# Altium project MacSet-L_V2.0.PrjPcb
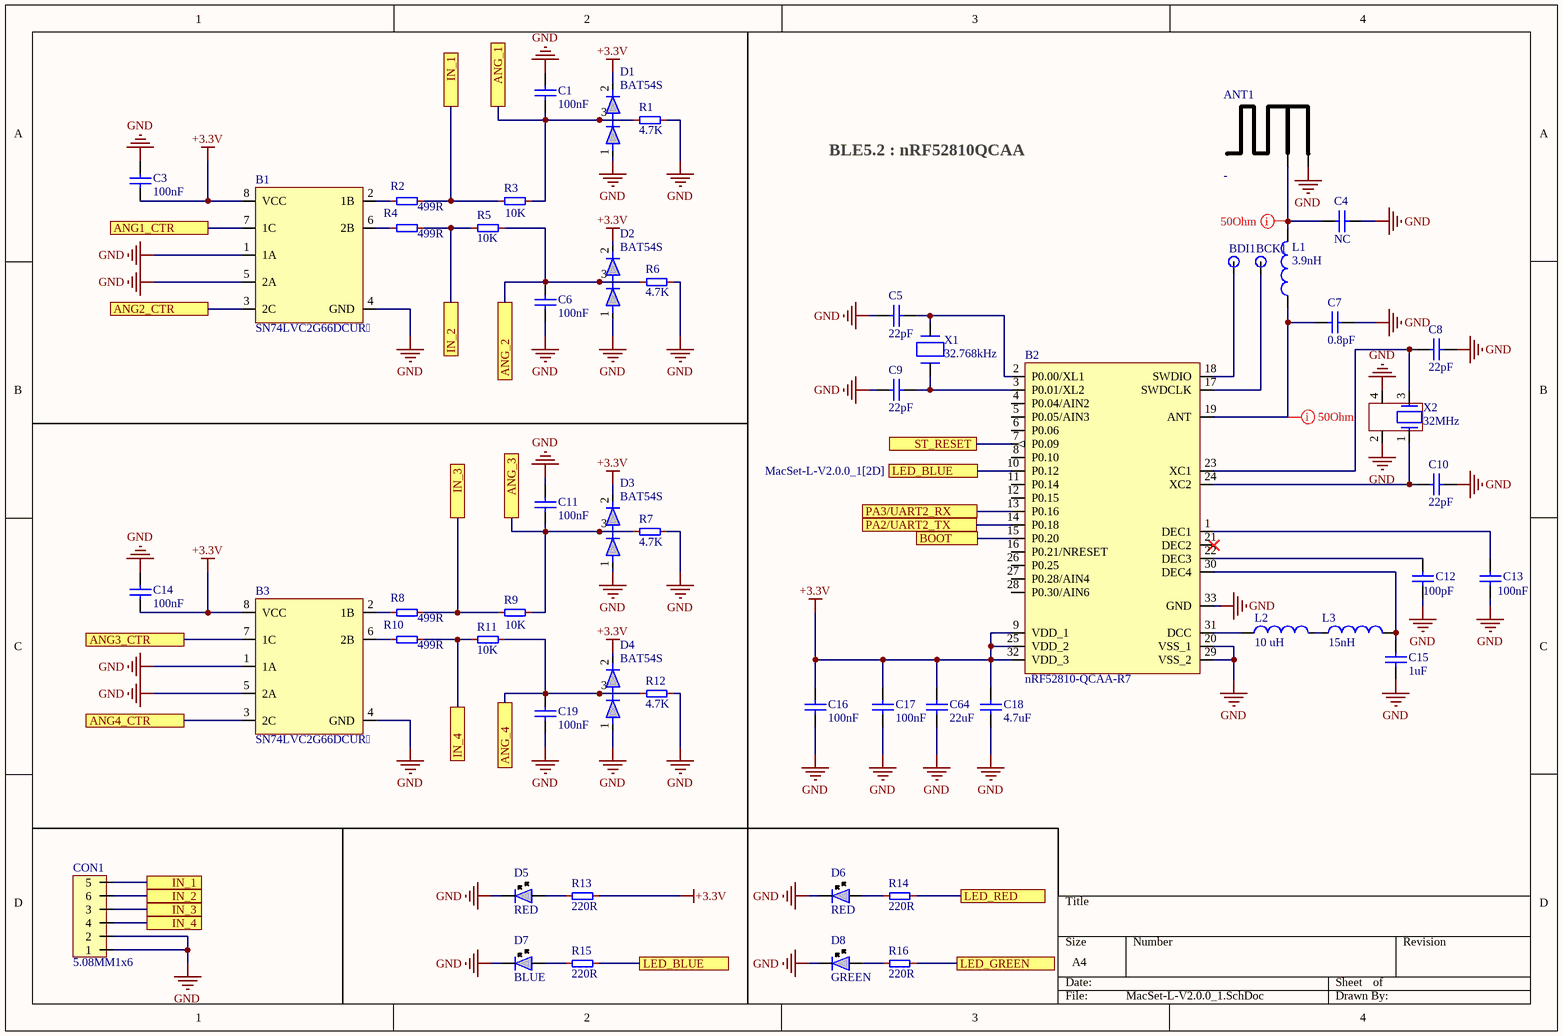
[diagram p0: MacSet-L-V2.0.0_1.SchDoc]
3 sheets, 169 parts. Net scope: flat (ports and power ports of the same name join across sheets).
Board file: MacSet-L_V2.0.PcbDoc
Sheets:
  MacSet-L-V2.0.0_1.SchDoc
  MacSet-L-V2.0.0_2.SchDoc
  MacSet-L-V2.0.0_3.SchDoc

## Sheet MacSet-L-V2.0.0_1.SchDoc
size A4; SheetNumber: 1; SheetTotal: 3

### Parts
ANT1  -  [2.4GHz PCB Anttenna]  (net tie, no BOM)
B1  SN74LVC2G66DCUR  [SOP50P310X90-8N]
B2  nRF52810-QCAA-R7  [QFN50P500X500X95-33N]
B3  SN74LVC2G66DCUR  [SOP50P310X90-8N]
BCK1  -  [TH_Pad]  (value not drawn)  (net tie, no BOM)
BDI1  -  [TH_Pad]  (value not drawn)  (net tie, no BOM)
C1  100nF  [CAP0402]
C3  100nF  [CAP0402]
C4  NC  [CAP0402]  (net tie, no BOM)
C5  22pF  [CAP0402]
C6  100nF  [CAP0402]
C7  0.8pF  [CAP0402]
C8  22pF  [CAP0402]
C9  22pF  [CAP0402]
C10  22pF  [CAP0402]
C11  100nF  [CAP0402]
C12  100pF  [CAP0402]
C13  100nF  [CAP0402]
C14  100nF  [CAP0402]
C15  1uF  [CAP0603]
C16  100nF  [CAP0402]
C17  100nF  [CAP0402]
C18  4.7uF  [CAP0603]
C19  100nF  [CAP0402]
C64  22uF  [CAP0805]
CON1  5.08MM1x6  [Screw Terminal Block 5.08x6]
D1  BAT54S  [SOT23]
D2  BAT54S  [SOT23]
D3  BAT54S  [SOT23]
D4  BAT54S  [SOT23]
D5  RED  [LED_3MM]
D6  RED  [LED_3MM]
D7  BLUE  [LED_3MM]
D8  GREEN  [LED_3MM]
L1  3.9nH  [IND_0402]
L2  value 10 uH  [IND_0603]  (hidden comment: 10uH)
L3  15nH  [IND_0402]
R1  4.7K  [RESC0402]
R2  499R  [RESC0805]
R3  10K  [RESC0402]
R4  499R  [RESC0805]
R5  10K  [RESC0402]
R6  4.7K  [RESC0402]
R7  4.7K  [RESC0402]
R8  499R  [RESC0805]
R9  10K  [RESC0402]
R10  499R  [RESC0805]
R11  10K  [RESC0402]
R12  4.7K  [RESC0402]
R13  220R  [RESC0402]
R14  220R  [RESC0402]
R15  220R  [RESC0402]
R16  220R  [RESC0402]
X1  32.768kHz  [OSC_3215]
X2  value 32MHz  [OSC_2016]  (hidden comment: OSC_2016)

### Ports
ANG1_CTR (see MacSet-L-V2.0.0_2[3A]), ANG2_CTR (see MacSet-L-V2.0.0_2[3A]), ANG3_CTR (see MacSet-L-V2.0.0_2[3A]), ANG4_CTR (see MacSet-L-V2.0.0_2[3A]), ANG_1 (see MacSet-L-V2.0.0_2[4A]), ANG_2 (see MacSet-L-V2.0.0_2[4A]), ANG_3 (see MacSet-L-V2.0.0_2[4A]), ANG_4 (see MacSet-L-V2.0.0_2[3A]), BOOT (see MacSet-L-V2.0.0_2[3A]), IN_1 (see MacSet-L-V2.0.0_1[1D]), IN_1 (see MacSet-L-V2.0.0_1[2A]), IN_2 (see MacSet-L-V2.0.0_1[1D]), IN_2 (see MacSet-L-V2.0.0_1[2B]), IN_3 (see MacSet-L-V2.0.0_1[1D]), IN_3 (see MacSet-L-V2.0.0_1[2C]), IN_4 (see MacSet-L-V2.0.0_1[1D]), IN_4 (see MacSet-L-V2.0.0_1[2C]), LED_BLUE (see MacSet-L-V2.0.0_1[2D]), LED_BLUE (see MacSet-L-V2.0.0_1[3B]), LED_GREEN (see MacSet-L-V2.0.0_2[4B]), LED_RED (see MacSet-L-V2.0.0_2[4A]), PA2/UART2_TX (see MacSet-L-V2.0.0_2[2D], MacSet-L-V2.0.0_2[3A]), PA3/UART2_RX (see MacSet-L-V2.0.0_2[2D], MacSet-L-V2.0.0_2[3A]), ST_RESET (see MacSet-L-V2.0.0_2[2A], MacSet-L-V2.0.0_2[3D])

### Nets
+3.3V: B1.8(VCC) B2.9(VDD_1) B2.25(VDD_2) B2.32(VDD_3) B3.8(VCC) C3.2 C14.2 C16.2 C17.2 C18.2 C64.2 D1.2 D2.2 D3.2 D4.2 R13.1
GND: ANT1.2(GND) B1.1(1A) B1.4(GND) B1.5(2A) B2.20(VSS_1) B2.29(VSS_2) B2.33(GND) B3.1(1A) B3.4(GND) B3.5(2A) C1.2 C3.1 C4.1 C5.1 C6.1 C7.1 C8.2 C9.1 C10.2 C11.2 C12.2 C13.2 C14.1 C15.1 C16.1 C17.1 C18.1 C19.1 C64.1 CON1.1 CON1.2 D1.1 D2.1 D3.1 D4.1 D5.1(K) D6.1(K) D7.1(K) D8.1(K) R1.1 R6.1 R7.1 R12.1 X2.2 X2.4
NetANT1_1: ANT1.1(FEED) C4.2 L1.2
NetB1_2: B1.2(1B) R2.1
NetB1_3: B1.3(2C) ; port ANG2_CTR
NetB1_6: B1.6(2B) R4.1
NetB1_7: B1.7(1C) ; port ANG1_CTR
NetB2_1: B2.1(DEC1) C13.1
NetB2_2: B2.2(P0.00/XL1) C5.2 X1.2(X2)
NetB2_3: B2.3(P0.01/XL2) C9.2 X1.1(X1)
NetB2_7: B2.7(P0.09) ; port ST_RESET
NetB2_10: B2.10(P0.12) R15.1 ; port LED_BLUE
NetB2_13: B2.13(P0.16) ; port PA3/UART2_RX
NetB2_14: B2.14(P0.18) ; port PA2/UART2_TX
NetB2_15: B2.15(P0.20) ; port BOOT
NetB2_17: B2.17(SWDCLK) BCK1.1
NetB2_18: B2.18(SWDIO) BDI1.1
NetB2_19: B2.19(ANT) C7.2 L1.1
NetB2_22: B2.22(DEC3) C12.1
NetB2_23: B2.23(XC1) C8.1 X2.3
NetB2_24: B2.24(XC2) C10.1 X2.1
NetB2_30: B2.30(DEC4) C15.2 L3.2
NetB2_31: B2.31(DCC) L2.1
NetB3_2: B3.2(1B) R8.1
NetB3_3: B3.3(2C) ; port ANG4_CTR
NetB3_6: B3.6(2B) R10.1
NetB3_7: B3.7(1C) ; port ANG3_CTR
NetC1_1: C1.1 D1.3 R1.2 R3.1 ; port ANG_1
NetC6_2: C6.2 D2.3 R5.1 R6.2 ; port ANG_2
NetC11_1: C11.1 D3.3 R7.2 R9.1 ; port ANG_3
NetC19_2: C19.2 D4.3 R11.1 R12.2 ; port ANG_4
NetCON1_3: CON1.3 R8.2 R9.2 ; port IN_3
NetCON1_4: CON1.4 R10.2 R11.2 ; port IN_4
NetCON1_5: CON1.5 R2.2 R3.2 ; port IN_1
NetCON1_6: CON1.6 R4.2 R5.2 ; port IN_2
NetD5_2: D5.2(A) R13.2
NetD6_2: D6.2(A) R14.2
NetD7_2: D7.2(A) R15.2
NetD8_2: D8.2(A) R16.2
NetL2_2: L2.2 L3.1
NetR14_1: R14.1 ; port LED_RED
NetR16_1: R16.1 ; port LED_GREEN

Not connected (* = marked no-connect by the designer): B2 4(P0.04/AIN2) 5(P0.05/AIN3) 6(P0.06) 8(P0.10) 11(P0.14) 12(P0.15) 16(P0.21/NRESET) 21(DEC2)* 26(P0.25) 27(P0.28/AIN4) 28(P0.30/AIN6)

### Layout directives
net class 50Ohm; rule Width Constraint [Pref Width = 0.254mm    Min Width = 0.254mm    Max Width = 0.254mm]: NetANT1_1, NetB2_19

### Notes on the sheet
- BLE5.2 : nRF52810QCAA

### Library data of the parts
ANT1 = 2.4GHz Antenna: 2.4GHq Inverted F antenna 1.6mm Thikness
B1 B3 = SN74LVC2G66DCUR: 2-Channel, 1:1 Analog Switch with Low On-State Resistance; Manufacturer: Texas Instruments; Manufacturer_Part_Number: SN74LVC2G66DCUR
B2 = nRF52810-QCAA-R7: NORDIC SEMICONDUCTOR - NRF52810-QCAA-R7 - RF Transceiver, 2.36GHz to 2.5GHz, FSK, 2Mbps, 4dBm out, -89dBm in, 1.7V to 3.6V, QFN-32; Manufacturer: Nordic Semiconductor; Manufacturer_Part_Number: nRF52810-QCAA-R7
BCK1 BDI1 = TH_PAD: Through Hole pad 1mm 0.5mm Hole
C1 C3 C6 C11 C14 C19 = Capa_0402: Ceramic Capacitor C0G, NP0 0402 100nF 35V; Manufacturer_Part_Number: GRM155R61A104KA01J; Manufacturer: MURATA
C4 = Capa_0402
C5 C8-C10 = Capa_0402: Multilayer Ceramic Capacitors MLCC - SMD/SMT 50 V 22pF C0G 0402 5%; Manufacturer_Part_Number: GCM1555C1H220JA16D; Manufacturer: Murata
C7 = Capa_0402: Ceramic Capacitor C0G, NP0 0402 0.8pF 50V; Manufacturer_Part_Number: CC0402BRNPO9BNR80; Manufacturer: YAGEO
C12 = Capa_0402: Ceramic Capacitor C0G, NP0 0402 100pF 50V; Manufacturer_Part_Number: GRM1555C1H101GA01D; Manufacturer: MURATA
C13 C16 C17 = Capa_0402: Ceramic Capacitor X7R 0402 100nF 16V; Manufacturer_Part_Number: GRM155R71C104JA88D; Manufacturer: MURATA
C15 = Capa_0603: MLCC - SMD/SMT 1 uF 16 VDC 10% 0603 X5R; Manufacturer_Part_Number: GRM188R61C105MA12D; Manufacturer: MURATA
C18 = Capa_0603: MLCC - SMD/SMT 4.7 uF 16 VDC 10% 0603 X5R; Manufacturer_Part_Number: CL10A475KQ8NNNC; Manufacturer: Samsung Electro-Mechanics
C64 = Capa_0805: MLCC - SMD/SMT 22uF 10VDC 20% 0805 X6S; Manufacturer_Part_Number: CC0805KKX7R6BB226; Manufacturer: MURATA
CON1 = Screw Terminal Block 6x1 5.08mm: 5.08mm 1*6 Screw Terminal Block; Manufacturer: XINYA; Manufacturer_Part_Number: *; Supplier: ROBU; Price: *; Package: 1x6x3.5
D1-D4 = BAT54SWT1G: BAT54S Schottky Diodes & Rectifiers SS SHKY DIO 30V TR; Manufacturer_Part_Number: Nexperia; Manufacturer: BAT54S,235
D5 D6 = LED_3MM: LED 3MM Through Hole RED; Manufacturer_Part_Number: *; Manufacturer: *; Supplier: *; Price: *; Package: 0603
D7 = LED_3MM: LED 3MM Through Hole BLUE; Manufacturer_Part_Number: *; Manufacturer: *; Supplier: *; Price: *; Package: 0603
D8 = LED_3MM: LED 3MM Through Hole GREEN; Manufacturer_Part_Number: *; Manufacturer: *; Supplier: *; Price: *; Package: 0603
L1 = Inductor: 3.9nH High frequency chip inductor ±5%  0402; Manufacturer_Part_Number: LQG15HS3N9B02D; Manufacturer: Murata
L2 = MCD-01330: 250mA 10uH ±20% 90mΩ 0603 Inductors; Manufacturer_Part_Number: MLZ1608M100WT000; Manufacturer: TDK
L3 = MCD-01330: 400mA 15nH ±5% 350mΩ 0402 Inductors; Manufacturer_Part_Number: MLG1005S15NJT000; Manufacturer: Murata; Value: 15nH
R1 R6 R7 R12 = RES_0402: Thin Film Resistors - SMD 4.7Kohms 0.1% 0402 25ppm; Manufacturer_Part_Number: RT0402BRD074K7L; Manufacturer: YAGEO; Parameter 1: *
R2 R4 R8 R10 = RES_0805: Thin Film Resistors - SMD 499ohms 0.1% 25ppm; Manufacturer_Part_Number: TNPW0805499RBEEA; Manufacturer: Vishay; Parameter 1: *
R3 R5 R9 R11 = RES_0402: Thick Film Resistors - SMD 1/16watt 10Kohms 0.1% 0402 Commercial Use; Manufacturer_Part_Number: MCS04020D1002BE000; Manufacturer: Vishay; Parameter 1: *
R13-R16 = RES_0402: Thick Film Resistors - SMD 1/16watt 220R 0402 1% Commercial Use; Manufacturer_Part_Number: RC0402FR-07220RL; Manufacturer: Vishay; Parameter 1: *
X1 = OSC_2012: Crystal Osc 3215 32.768kHz 12pF; Manufacturer_Part_Number: ECS-.327-12.5-34B-TR; Manufacturer: ECS; Value: 32.768kHz
X2 = OSC_2016: Crystal Osc 2016 32MHz 12pF  60R; Manufacturer_Part_Number: XRCGB32M000F1SADR0; Manufacturer: Murata

## Sheet MacSet-L-V2.0.0_2.SchDoc
size A4; SheetNumber: 2; SheetTotal: 3
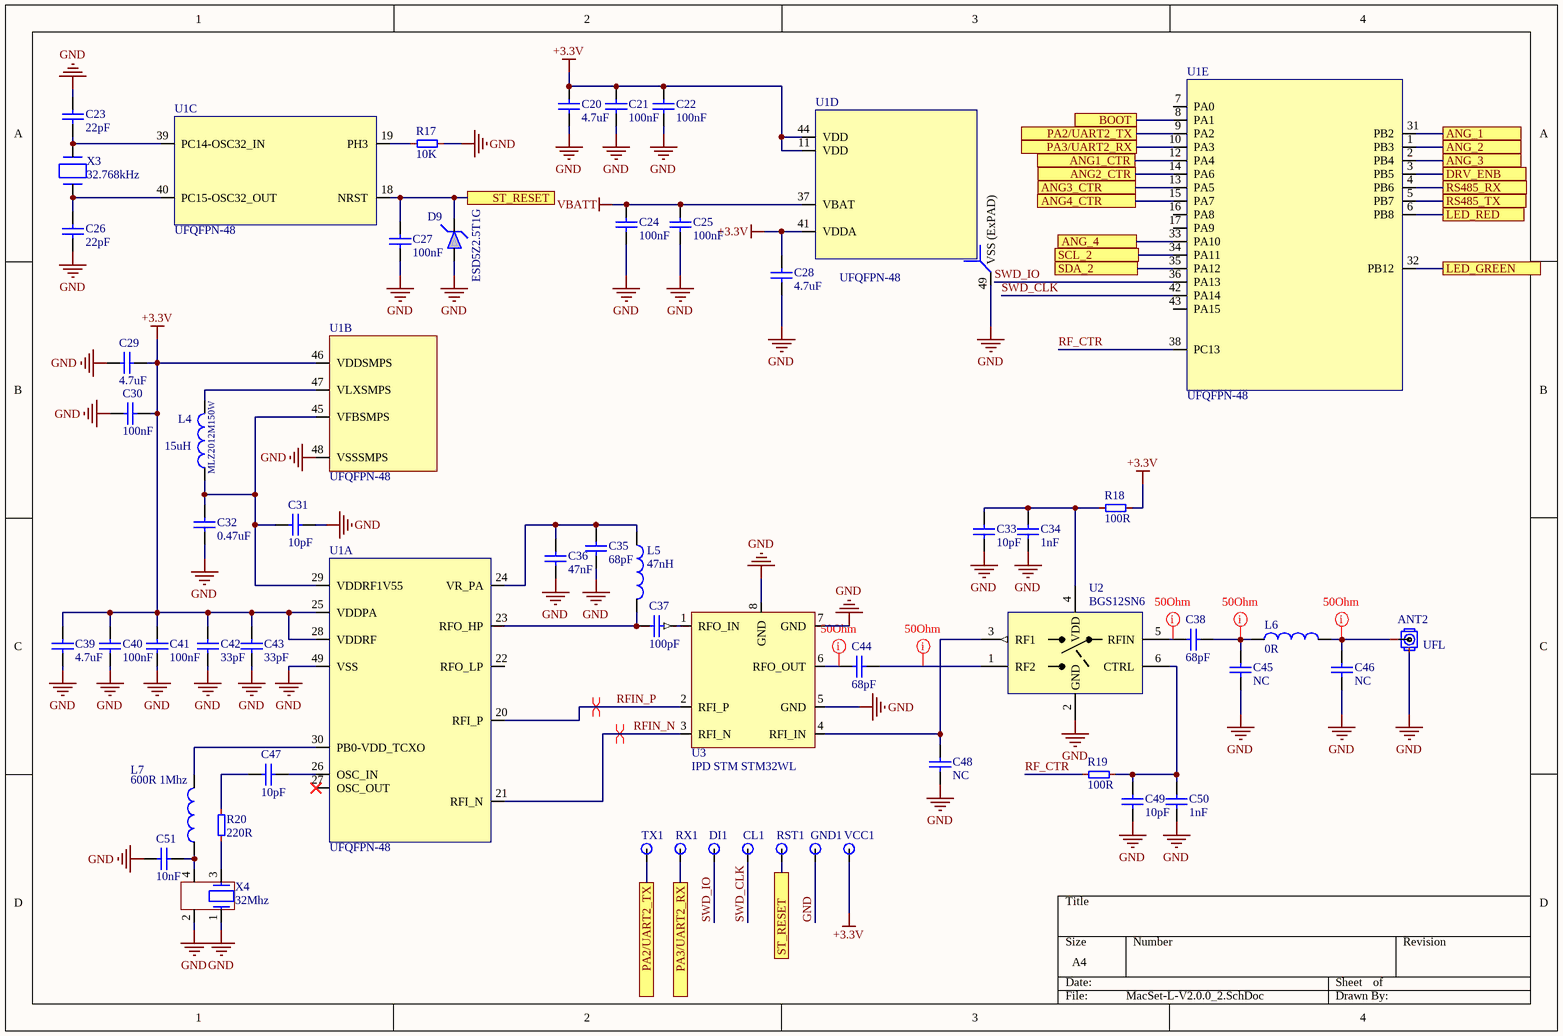
[diagram p1: MacSet-L-V2.0.0_2.SchDoc]

### Parts
ANT2  UFL  [UFL]
C20  4.7uF  [CAP0603]
C21  100nF  [CAP0402]
C22  100nF  [CAP0402]
C23  22pF  [CAP0402]
C24  100nF  [CAP0402]
C25  100nF  [CAP0402]
C26  22pF  [CAP0402]
C27  100nF  [CAP0402]
C28  4.7uF  [CAP0603]
C29  4.7uF  [CAP0603]
C30  100nF  [CAP0402]
C31  10pF  [CAP0402]
C32  0.47uF  [CAP0603]
C33  10pF  [CAP0402]
C34  1nF  [CAP0402]
C35  68pF  [CAP0402]
C36  47nF  [CAP0402]
C37  100pF  [CAP0402]
C38  68pF  [CAP0402]
C39  4.7uF  [CAP0603]
C40  100nF  [CAP0402]
C41  100nF  [CAP0402]
C42  33pF  [CAP0402]
C43  33pF  [CAP0402]
C44  68pF  [CAP0402]
C45  NC  [CAP0402]
C46  NC  [CAP0402]
C47  10pF  [CAP0402]
C48  NC  [CAP0402]  (net tie, no BOM)
C49  10pF  [CAP0402]
C50  1nF  [CAP0402]
C51  10nF  [CAP0402]
CL1  -  [TH_Pad]  (value not drawn)  (net tie, no BOM)
D9  ESD5Z2.5T1G  [SOD523]
DI1  -  [TH_Pad]  (value not drawn)  (net tie, no BOM)
GND1  -  [TH_Pad]  (value not drawn)  (net tie, no BOM)
L4  Manufacturer_Part_Number: MLZ2012M150W  [IND_2012]  (hidden comment: 15uH)
L5  47nH  [IND_0402]
L6  0R  [IND_0402]
L7  600R 1Mhz  [IND_0402]
R17  10K  [RESC0402]
R18  100R  [RESC0402]
R19  100R  [RESC0402]
R20  220R  [RESC0402]
RST1  -  [TH_Pad]  (value not drawn)  (net tie, no BOM)
RX1  -  [TH_Pad]  (value not drawn)  (net tie, no BOM)
TX1  -  [TH_Pad]  (value not drawn)  (net tie, no BOM)
U1  UFQFPN-48  [STM32WLxx_QFN48]  (parts A,B,C,D,E of 5)
U2  BGS12SN6  [SON40P70X40-6N]
U3  IPD STM STM32WL  [IPD STM]
VCC1  -  [TH_Pad]  (value not drawn)  (net tie, no BOM)
X3  32.768kHz  [OSC_3215]
X4  value 32Mhz  [OSC_2016]  (hidden comment: OSC_2016)

### Ports
ANG1_CTR (see MacSet-L-V2.0.0_1[1A]), ANG2_CTR (see MacSet-L-V2.0.0_1[1B]), ANG3_CTR (see MacSet-L-V2.0.0_1[1C]), ANG4_CTR (see MacSet-L-V2.0.0_1[1C]), ANG_1 (see MacSet-L-V2.0.0_1[2A]), ANG_2 (see MacSet-L-V2.0.0_1[2B]), ANG_3 (see MacSet-L-V2.0.0_1[2C]), ANG_4 (see MacSet-L-V2.0.0_1[2C]), BOOT (see MacSet-L-V2.0.0_1[3C]), DRV_ENB (see MacSet-L-V2.0.0_3[1A]), LED_GREEN (see MacSet-L-V2.0.0_1[3D]), LED_RED (see MacSet-L-V2.0.0_1[3D]), PA2/UART2_TX (see MacSet-L-V2.0.0_1[3C], MacSet-L-V2.0.0_2[2D]), PA2/UART2_TX (see MacSet-L-V2.0.0_1[3C], MacSet-L-V2.0.0_2[3A]), PA3/UART2_RX (see MacSet-L-V2.0.0_1[3B], MacSet-L-V2.0.0_2[2D]), PA3/UART2_RX (see MacSet-L-V2.0.0_1[3B], MacSet-L-V2.0.0_2[3A]), RS485_RX (see MacSet-L-V2.0.0_3[1A]), RS485_TX (see MacSet-L-V2.0.0_3[1B]), SCL_2 (see MacSet-L-V2.0.0_3[3C]), SDA_2 (see MacSet-L-V2.0.0_3[3B]), ST_RESET (see MacSet-L-V2.0.0_1[3B], MacSet-L-V2.0.0_2[2A]), ST_RESET (see MacSet-L-V2.0.0_1[3B], MacSet-L-V2.0.0_2[3D])

### Nets
+3.3V: C20.2 C21.1 C22.1 C28.2 C29.2 C30.1 C39.2 C40.1 C41.1 C42.1 C43.1 R18.1 U1.11(VDD) U1.25(VDDPA) U1.28(VDDRF) U1.41(VDDA) U1.44(VDD) U1.46(VDDSMPS) VCC1.1
GND: ANT2.2(Value) C20.1 C21.2 C22.2 C23.2 C24.2 C25.2 C26.1 C27.2 C28.1 C29.1 C30.2 C31.1 C32.1 C33.1 C34.1 C35.1 C36.1 C39.1 C40.2 C41.2 C42.2 C43.2 C45.1 C46.1 C48.2 C49.1 C50.1 C51.2 D9.2(A) GND1.1 R17.1 U1.48(VSSSMPS) U1.49(VSS_(ExPAD)) U2.2(GND) U3.5(GND) U3.7(GND) U3.8(GND) X4.1 X4.2
VBATT: C24.1 C25.1 U1.37(VBAT)
RF_CTR: R19.1 U1.38(PC13)
RFIN_N: U1.21(RFI_N) U3.3(RFI_N)
RFIN_P: U1.20(RFI_P) U3.2(RFI_P)
SWD_CLK: CL1.1 U1.42(PA14)
SWD_IO: DI1.1 U1.36(PA13)
NetANT2_1: ANT2.1(Value) C46.2 L6.2
NetB1_3: U1.14(PA6) ; port ANG2_CTR
NetB1_7: U1.12(PA4) ; port ANG1_CTR
NetB2_7: C27.1 D9.1(K) RST1.1 U1.18(NRST) ; port ST_RESET
NetB2_13: RX1.1 U1.10(PA3) ; port PA3/UART2_RX
NetB2_14: TX1.1(RX) U1.9(PA2) ; port PA2/UART2_TX
NetB2_15: U1.8(PA1) ; port BOOT
NetB3_3: U1.15(PA7) ; port ANG4_CTR
NetB3_7: U1.13(PA5) ; port ANG3_CTR
NetC1_1: U1.31(PB2) ; port ANG_1
NetC6_2: U1.1(PB3) ; port ANG_2
NetC11_1: U1.2(PB4) ; port ANG_3
NetC19_2: U1.33(PA10) ; port ANG_4
NetC23_1: C23.1 U1.39(PC14-OSC32_IN) X3.2(X2)
NetC26_2: C26.2 U1.40(PC15-OSC32_OUT) X3.1(X1)
NetC31_2: C31.2 C32.2 L4.1 U1.29(VDDRF1V55) U1.45(VFBSMPS)
NetC33_2: C33.2 C34.2 R18.2 U2.4(VDD)
NetC35_2: C35.2 C36.2 L5.1 U1.24(VR_PA)
NetC37_1: C37.1 U3.1(RFO_IN)
NetC37_2: C37.2 L5.2 U1.23(RFO_HP)
NetC38_1: C38.1 C45.2 L6.1
NetC38_2: C38.2 U2.5(RFIN)
NetC44_1: C44.1 U2.1(RF2)
NetC44_2: C44.2 U3.6(RFO_OUT)
NetC47_1: C47.1 R20.2
NetC47_2: C47.2 U1.26(OSC_IN)
NetC48_1: C48.1 U2.3(RF1) U3.4(RFI_IN)
NetC49_2: C49.2 C50.2 R19.2 U2.6(CTRL)
NetC51_1: C51.1 L7.1 X4.4
NetL4_2: L4.2 U1.47(VLXSMPS)
NetL7_2: L7.2 U1.30(PB0-VDD_TCXO)
NetR14_1: U1.6(PB8) ; port LED_RED
NetR16_1: U1.32(PB12) ; port LED_GREEN
NetR17_2: R17.2 U1.19(PH3)
NetR20_1: R20.1 X4.3
NetR22_1: U1.4(PB6) ; port RS485_RX
NetR28_2: U1.3(PB5) ; port DRV_ENB
NetR36_2: U1.35(PA12) ; port SDA_2
NetR37_2: U1.34(PA11) ; port SCL_2
NetU1_5: U1.5(PB7) ; port RS485_TX

Not connected (* = marked no-connect by the designer): U1 7(PA0) 16(PA8) 17(PA9) 22(RFO_LP) 27(OSC_OUT)* 43(PA15)

### Layout directives
net class 50Ohm; rule Width Constraint [Pref Width = 0.254mm    Min Width = 0.254mm    Max Width = 0.254mm]: NetANT2_1, NetC38_1, NetC38_2, NetC44_1, NetC44_2
differential pair: RFIN_N, RFIN_P

### Library data of the parts
ANT2 = SMA Antenna: SMA Connector
C20 C28 C29 C39 = Capa_0603: as C18 on sheet MacSet-L-V2.0.0_1
C21 C22 C24 C25 C27 C30 C40 C41 = Capa_0402: as C13 on sheet MacSet-L-V2.0.0_1
C23 C26 = Capa_0402: as C5 on sheet MacSet-L-V2.0.0_1
C31 C33 C47 C49 = Capa_0402: Multilayer Ceramic Capacitors MLCC - SMD/SMT 50 V 10pF C0G 0402 10%; Manufacturer_Part_Number: CC0402JRNPO9BN100; Manufacturer: YAGEO
C32 = Capa_0603: MLCC - SMD/SMT 0.47 uF 16 VDC 10% 0603 X5R; Manufacturer_Part_Number: CC0603KRX7R0BB474; Manufacturer: Yageo
C34 C50 = Capa_0402: Multilayer Ceramic Capacitors MLCC - SMD/SMT 50 V 1nF C0G 0402 10%; Manufacturer_Part_Number: CC0402KRX7R9BB102; Manufacturer: YAGEO
C35 C38 C44 = Capa_0402: Multilayer Ceramic Capacitors MLCC - SMD/SMT 50 V 68pF C0G 0402 5%; Manufacturer_Part_Number: CC0402JRNPO9BN680; Manufacturer: YAGEO
C36 = Capa_0402: Multilayer Ceramic Capacitors MLCC - SMD/SMT 50 V 47nF C0G 0402 10%; Manufacturer_Part_Number: 0402B473K500CT; Manufacturer: Walsin
C37 = Capa_0402: Multilayer Ceramic Capacitors MLCC - SMD/SMT 50 V 100pF C0G 0402 10%; Manufacturer_Part_Number: CC0402KRNPO9BN101; Manufacturer: YAGEO
C42 C43 = Capa_0402: Ceramic Capacitor C0G, NP0 0402 33pF 35V; Manufacturer_Part_Number: CC0402JRNPO9BN330; Manufacturer: MURATA
C45 C46 = Capa_0402: Multilayer Ceramic Capacitors MLCC - SMD/SMT 50 V 2.4pF C0G 0402 10%; Manufacturer_Part_Number: CC0402CRNPO9BN2R4; Manufacturer: YAGEO
C48 = Capa_0402: Manufacturer_Part_Number: -; Manufacturer: -
C51 = Capa_0402: Multilayer Ceramic Capacitors MLCC - SMD/SMT 50 V 10nF C0G 0402 10%; Manufacturer_Part_Number: CC0402KRX7R9BB103; Manufacturer: YAGEO
CL1 DI1 GND1 RST1 RX1 TX1 VCC1 = TH_PAD: Through Hole pad 1mm 0.5mm Hole
D9 = DIODE-ESD: ESD Protection Diodes / TVS Diodes 2.5V ESD Protection Unidirectional; Manufacturer: onsemi; Manufacturer_Part_Number: ESD5Z2.5T1G
L4 = MCD-01433: MLZ2012 Multilayer Shielded Inductor 15µH, ±5%; Manufacturer: TDK; Value: 15uH
L5 = Inductor: 47nH High frequency chip inductor ±5%  0402; Manufacturer_Part_Number: LQG15HN47NJ02D; Manufacturer: Murata
L6 = Inductor: Thick Film Resistors - SMD 1/16watt 0R 1% 0402 Commercial Use; Manufacturer_Part_Number: RC0402FR-070RL; Manufacturer: YAGIO
L7 = Inductor: 47nH High frequency chip inductor ±5%  0402; Manufacturer_Part_Number: GZ1005D601TF; Manufacturer: Murata
R17 = RES_0402: Thick Film Resistors - SMD 1/16watt 10Kohms 0402 1% Commercial Use; Manufacturer_Part_Number: CRCW040210K0FKEDC; Manufacturer: Vishay; Parameter 1: *
R18 R19 = RES_0402: Thin Film Resistors 100 OHM 1% 50PPM 1/1 6W 0402; Manufacturer_Part_Number: RC0402FR-07100RL; Manufacturer: YAGEO; Parameter 1: *
R20 = RES_0402: Thin Film Resistors 220 OHM 1% 50PPM 1/1 6W 0402; Manufacturer_Part_Number: 0402WGF2200TCE; Manufacturer: Royalohm; Parameter 1: *
U1 = STM32WLE5C8U6_O: ARM Microcontrollers - MCU Sub-GHz Wireless Microcontrollers. Arm Cortex-M4 a.48 MHz 64 Kbytes of Flash 20 K; Manufacturer: STMicroelectronics; Manufacturer_Part_Number: STM32WL5CCU6
U2 = BGS12SN6: DC switch - Ultra-Low  SPDT analog switch; Manufacturer: INFINEON; Manufacturer_Part_Number: BGS12SN6
U3 = IPD ST STM32WL: Manufacturer: STMICROELECTRONICS; Manufacturer_Part_Number: MLPF-WL-02D3
X3 = OSC_2012: as X1 on sheet MacSet-L-V2.0.0_1; Value: 32.768kHz
X4 = OSC_2016: TCXO Oscillators TG2016SMN 32.0000M-MCGNNM0: TCXO 2.8V 3.3V 0.5PPM -40 85C NON O/E 1K TR; Manufacturer: Epson; Manufacturer_Part_Number: TG2016SMN 32.0000M-MCGNNM0

## Sheet MacSet-L-V2.0.0_3.SchDoc
size A4; SheetNumber: 3; SheetTotal: 3
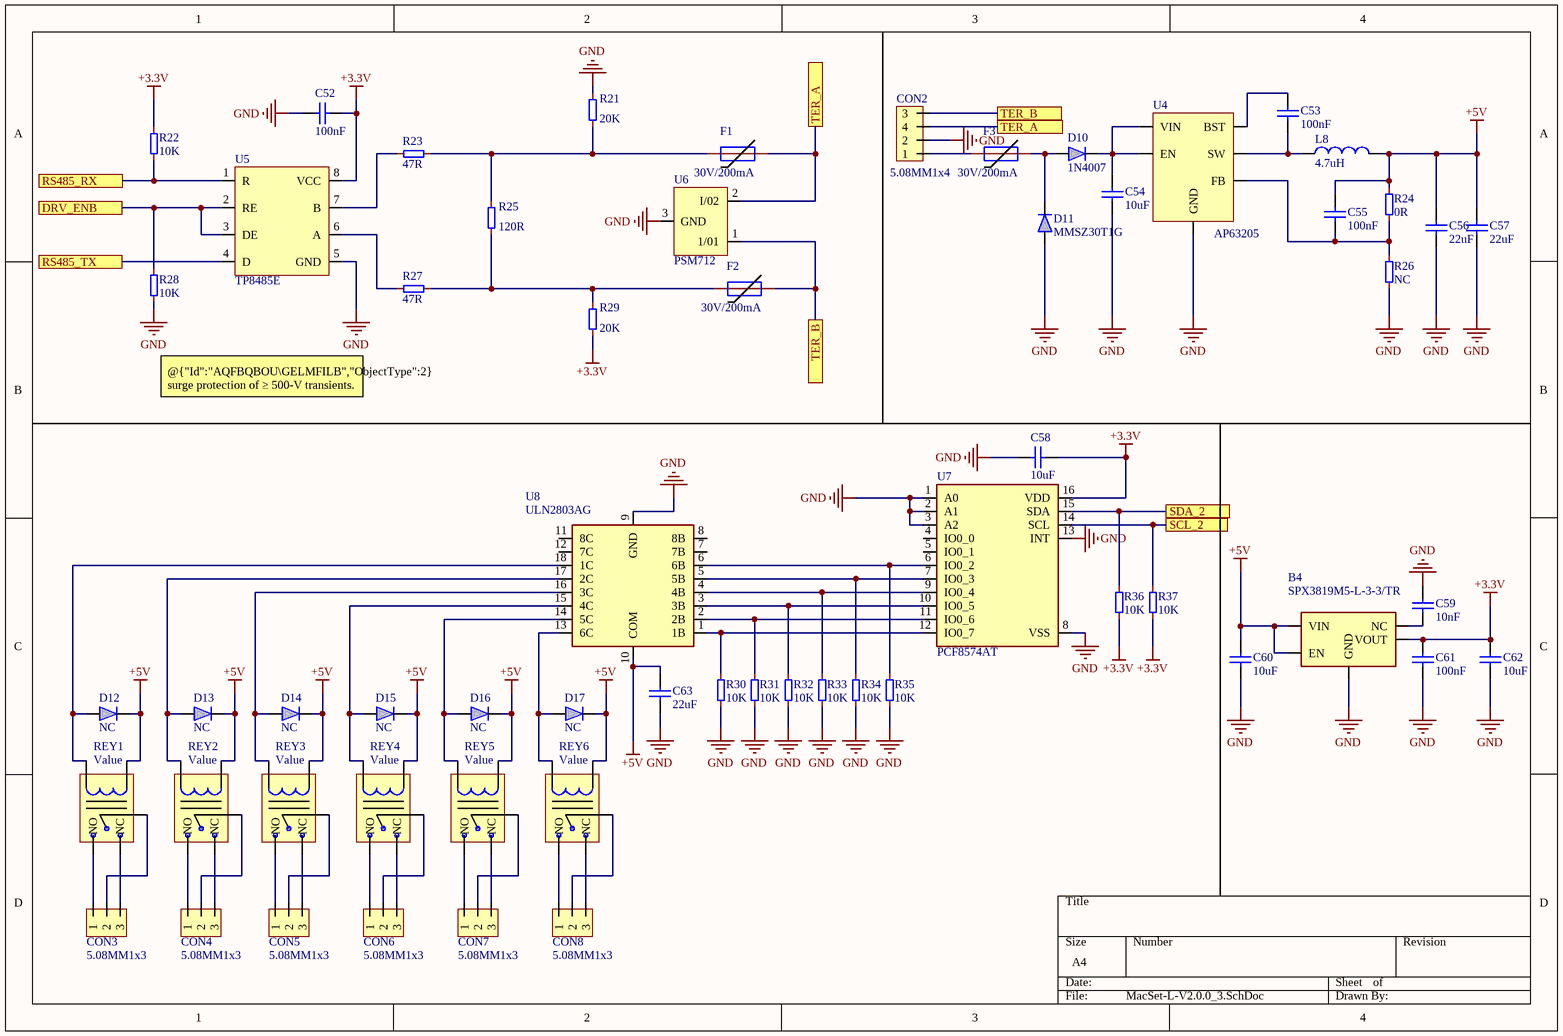
[diagram p2: MacSet-L-V2.0.0_3.SchDoc]

### Parts
B4  SPX3819M5-L-3-3/TR  [SOT95P285X140-5N]
C52  100nF  [CAP0402]
C53  100nF  [CAP0402]
C54  10uF  [CAP0805]
C55  100nF  [CAP0402]
C56  22uF  [CAP0805]
C57  22uF  [CAP0805]
C58  10uF  [CAP0603]
C59  10nF  [CAP0402]
C60  10uF  [CAP0603]
C61  100nF  [CAP0402]
C62  10uF  [CAP0603]
C63  22uF  [CAP0805]
CON2  5.08MM1x4  [Screw Terminal Block 5.08x4]
CON3  5.08MM1x3  [Screw Terminal Block 5.08x3]
CON4  5.08MM1x3  [Screw Terminal Block 5.08x3]
CON5  5.08MM1x3  [Screw Terminal Block 5.08x3]
CON6  5.08MM1x3  [Screw Terminal Block 5.08x3]
CON7  5.08MM1x3  [Screw Terminal Block 5.08x3]
CON8  5.08MM1x3  [Screw Terminal Block 5.08x3]
D10  1N4007  [Diode SMD 214AC]
D11  MMSZ30T1G  [SOD123-2]
D12  NC  [Diode SMD 214AC]
D13  NC  [Diode SMD 214AC]
D14  NC  [Diode SMD 214AC]
D15  NC  [Diode SMD 214AC]
D16  NC  [Diode SMD 214AC]
D17  NC  [Diode SMD 214AC]
F1  30V/200mA  [FUSE_1206]
F2  30V/200mA  [FUSE_1206]
F3  30V/200mA  [FUSE_1206]
L8  4.7uH  [IND_3x3x1.5MM]
R21  20K  [RESC0402]
R22  10K  [RESC0402]
R23  47R  [RESC0603]
R24  0R  [RESC0402]
R25  value 120R  [RESC0402]  (hidden comment: NC)
R26  NC  [RESC0402]
R27  47R  [RESC0603]
R28  10K  [RESC0402]
R29  20K  [RESC0402]
R30  10K  [RESC0402]
R31  10K  [RESC0402]
R32  10K  [RESC0402]
R33  10K  [RESC0402]
R34  10K  [RESC0402]
R35  10K  [RESC0402]
R36  10K  [RESC0402]
R37  10K  [RESC0402]
REY1  Value  [Relay]
REY2  Value  [Relay]
REY3  Value  [Relay]
REY4  Value  [Relay]
REY5  Value  [Relay]
REY6  Value  [Relay]
U4  AP63205  [SOT23-6]
U5  TP8485E  [SOIC8]
U6  PSM712  [SOT23]
U7  PCF8574AT  [SOIC-16-W]
U8  ULN2803AG  [SOIC-18-W]

### Ports
DRV_ENB (see MacSet-L-V2.0.0_2[4A]), RS485_RX (see MacSet-L-V2.0.0_2[4A]), RS485_TX (see MacSet-L-V2.0.0_2[4A]), SCL_2 (see MacSet-L-V2.0.0_2[3A]), SDA_2 (see MacSet-L-V2.0.0_2[3B]), TER_A (see MacSet-L-V2.0.0_3[3A]), TER_B (see MacSet-L-V2.0.0_3[3A]), TER_B (see MacSet-L-V2.0.0_3[3B])

### Nets
+3.3V: B4.5(VOUT) C52.2 C58.2 C61.2 C62.2 R22.2 R29.1 R36.1 R37.1 U5.8(VCC) U7.16(VDD)
+5V: B4.1(VIN) B4.3(EN) C55.2 C56.2 C57.2 C60.2 C63.1 D12.1(K) D13.1(K) D14.1(K) D15.1(K) D16.1(K) D17.1(K) L8.2 R24.1 REY1.1(+) REY2.1(+) REY3.1(+) REY4.1(+) REY5.1(+) REY6.1(+) U8.10(COM)
GND: B4.2(GND) C52.1 C54.1 C56.1 C57.1 C58.1 C59.1 C60.1 C61.1 C62.1 C63.2 CON2.2 D11.2(A) R21.2 R26.2 R28.1 R30.1 R31.1 R32.1 R33.1 R34.1 R35.1 U4.4(GND) U5.5(GND) U6.3(GND) U7.1(A0) U7.2(A1) U7.3(A2) U7.8(VSS) U7.13(INT) U8.9(GND)
NetB4_4: B4.4(NC) C59.2
NetC53_1: C53.1 L8.1 U4.5(SW)
NetC53_2: C53.2 U4.6(BST)
NetC54_2: C54.2 D10.1(K) U4.2(EN) U4.3(VIN)
NetC55_1: C55.1 R24.2 R26.1 U4.1(FB)
NetCON2_1: CON2.1 F3.1
NetCON2_3: CON2.3 F2.2 U6.1(1/01) ; port TER_B
NetCON2_4: CON2.4 F1.2 U6.2(I/02) ; port TER_A
NetCON3_1: CON3.1 REY1.4(NO)
NetCON3_2: CON3.2 REY1.2(CM)
NetCON3_3: CON3.3 REY1.5(NC)
NetCON4_1: CON4.1 REY2.4(NO)
NetCON4_2: CON4.2 REY2.2(CM)
NetCON4_3: CON4.3 REY2.5(NC)
NetCON5_1: CON5.1 REY3.4(NO)
NetCON5_2: CON5.2 REY3.2(CM)
NetCON5_3: CON5.3 REY3.5(NC)
NetCON6_1: CON6.1 REY4.4(NO)
NetCON6_2: CON6.2 REY4.2(CM)
NetCON6_3: CON6.3 REY4.5(NC)
NetCON7_1: CON7.1 REY5.4(NO)
NetCON7_2: CON7.2 REY5.2(CM)
NetCON7_3: CON7.3 REY5.5(NC)
NetCON8_1: CON8.1 REY6.4(NO)
NetCON8_2: CON8.2 REY6.2(CM)
NetCON8_3: CON8.3 REY6.5(NC)
NetD10_2: D10.2(A) D11.1(K) F3.2
NetD12_2: D12.2(A) REY1.3(-) U8.18(1C)
NetD13_2: D13.2(A) REY2.3(-) U8.17(2C)
NetD14_2: D14.2(A) REY3.3(-) U8.16(3C)
NetD15_2: D15.2(A) REY4.3(-) U8.15(4C)
NetD16_2: D16.2(A) REY5.3(-) U8.14(5C)
NetD17_2: D17.2(A) REY6.3(-) U8.13(6C)
NetF1_1: F1.1 R21.1 R23.2 R25.2
NetF2_1: F2.1 R25.1 R27.2 R29.2
NetR22_1: R22.1 U5.1(R) ; port RS485_RX
NetR23_1: R23.1 U5.7(B)
NetR27_1: R27.1 U5.6(A)
NetR28_2: R28.2 U5.2(RE) U5.3(DE) ; port DRV_ENB
NetR30_2: R30.2 U7.12(IO0_7) U8.1(1B)
NetR31_2: R31.2 U7.11(IO0_6) U8.2(2B)
NetR32_2: R32.2 U7.10(IO0_5) U8.3(3B)
NetR33_2: R33.2 U7.9(IO0_4) U8.4(4B)
NetR34_2: R34.2 U7.7(IO0_3) U8.5(5B)
NetR35_2: R35.2 U7.6(IO0_2) U8.6(6B)
NetR36_2: R36.2 U7.15(SDA) ; port SDA_2
NetR37_2: R37.2 U7.14(SCL) ; port SCL_2
NetU1_5: U5.4(D) ; port RS485_TX

Not connected (* = marked no-connect by the designer): U7 4(IO0_0) 5(IO0_1); U8 7(7B) 8(8B) 11(8C) 12(7C)

### Notes on the sheet
- @{"Id":"AQFBQBOU\GELMFILB","ObjectType":2} surge protection of ≥ 500-V transients.

### Library data of the parts
B4 = SPX3819M5: Linear Voltage Regulator IC Positive Fixed 1 3.3V Output 500mA SOT-25; Manufacturer: MAX Linear; Manufacturer_Part_Number: SPX3819M5-L-3-3/TR; Supplier: *; Price: *
C52 = Capa_0402: as C13 on sheet MacSet-L-V2.0.0_1
C53 C55 = Capa_0402: as C1 on sheet MacSet-L-V2.0.0_1
C54 = Capa_0805: MLCC - SMD/SMT 10 uF 50VDC 10% 0805 X6S; Manufacturer_Part_Number: CC0805KKX5R9BB106; Manufacturer: YAGEO
C56 = Capa_0805: MLCC - SMD/SMT 22uF 10VDC 20% 0805 X6S; Manufacturer_Part_Number: CC0805KKX7R6BB226; Manufacturer: YAGEO
C57 C63 = Capa_0805: as C64 on sheet MacSet-L-V2.0.0_1
C58 = CAP_0603: Ceramic Capacitor X5R 0603 10uF 10V; Manufacturer_Part_Number: CL10A106KP8NNNL; Manufacturer: SAMSUNG; Supplier: *; Package: 0603; Price: *
C59 = CAP_0402: Ceramic Capacitor X7R 0402 10nF 50V; Manufacturer_Part_Number: GCM155R71H103KA55J; Manufacturer: Murata; Supplier: ROBU; Package: 0402; Price: 0.15
C60 C62 = CAP_0603: Ceramic Capacitor X5R 0603 10uF 25V; Manufacturer_Part_Number: CL10A106MA8NRNC; Manufacturer: SAMSUNG; Supplier: ROBU; Package: 0603; Price: 1.8
C61 = CAP_0402: Ceramic Capacitor X7R 0402 100nF 50V; Manufacturer_Part_Number: CL05B104KA5NNNC; Manufacturer: SAMSUNG; Supplier: ROBU; Package: 0402; Price: 0.15
CON2 = Screw Terminal Block 4x1 5.08mm: 5.08mm 1*4 Screw Terminal Block; Manufacturer: XINYA; Manufacturer_Part_Number: *; Supplier: *; Price: *; Package: 1x4x3.5
CON3-CON8 = Screw Terminal Block 3x1 5.08mm: 5.08mm 1*3 Screw Terminal Block; Manufacturer_Part_Number: XY302V-3.5-3P; Manufacturer: XINYA; Supplier: ROBU; Price: 12; Package: 1x3x3.5
D10 D12-D17 = DIODE: Diode 1N4007 AO214AC; Manufacturer: GENERIC; Manufacturer_Part_Number: 1N4007; Supplier: *; Price: *; Package: AO214-AC
D11 = BAT54T1G: MMSZ30T1G 30V 500mW Schottky Diodes & Rectifiers; Manufacturer: Onsemi; Manufacturer_Part_Number: MMSZ30T1G
F1-F3 = FUSE_1206: Polymeric PTC Resettable Fuse 30V 200mA Surface Mount 1206; Manufacturer_Part_Number: nSMD020-30V; Manufacturer: TECHFUSE; Package: 1206
L8 = INDUCTOR: 1.09A 4.7uH ±3% 163mΩ 3015 Inductors; Manufacturer_Part_Number: SWPA3015S4R7MT; Manufacturer: SUNLORD; Package: 3015; Supplier: Evelta; Price: 6.9
R21 R29 = RES_0402: Resistor SMD 0402; Manufacturer_Part_Number: CRCW040220K0FKEDC; Manufacturer: YAGEO; Value: 20K
R22 R28 R30-R37 = RES_0402: as R17 on sheet MacSet-L-V2.0.0_2; Parameter 1: *
R23 R27 = RES_0603: Thick Film Resistors - SMD 1/16Watt 47ohms 1% Commercial Use; Manufacturer_Part_Number: RC0402FR-0747RL; Manufacturer: Vishay; Parameter 1: *
R24 = RES_0402: Thick Film Resistors - SMD 1/16watt 0R 1% 0402 Commercial Use; Manufacturer_Part_Number: RC0402FR-070RL; Manufacturer: Vishay; Parameter 1: *
R25 = RES_0402: Resistor SMD 0402; Manufacturer_Part_Number: *; Manufacturer: *
R26 = RES_0402: as R3 on sheet MacSet-L-V2.0.0_1; Parameter 1: *
REY1-REY6 = Relay: 5V Sugar Cube Relay 44mA
U4 = AP63205: AP63205 - Switching Voltage Regulators 5V OUT DCDC 3.8V-32V Conv HV Buck TSOT26 T&R 3K; Manufacturer_Part_Number: AP63205QWU-7; Manufacturer: Diodes Incorporated; Price: *
U5 = TP8485E: TP8485E RS485 Tranreciver 3V-5.5V SOIC8; Manufacturer: 3PEAK; Manufacturer_Part_Number: TP8485
U6 = PSM712: Asymmerical TVS Diode for Extended Common-Mode RS-485; Manufacturer_Part_Number: SM712H-TP-B002; Manufacturer: Micro Commercial Components (MCC)
U7 = PCF8574AT: PCF8574AT 8Bit I2C GPIO Expander 16 Pin; Manufacturer: NXP Semiconductors; Manufacturer_Part_Number: PCF8574AT; Package: SOIC-16
U8 = ULN2803AG: ULN2803C device is a 50V, 500mA Darlington / transistor array; Manufacturer: UMW; Manufacturer_Part_Number: ULN2803A; Package: SOIC-18

## Nets that join several sheets
+3.3V: MacSet-L-V2.0.0_1 (16 pins), MacSet-L-V2.0.0_2 (19 pins), MacSet-L-V2.0.0_3 (11 pins)
GND: MacSet-L-V2.0.0_1 (45 pins), MacSet-L-V2.0.0_2 (40 pins), MacSet-L-V2.0.0_3 (31 pins)
NetB1_3: MacSet-L-V2.0.0_1 (B1.3), MacSet-L-V2.0.0_2 (U1.14)
NetB1_7: MacSet-L-V2.0.0_1 (B1.7), MacSet-L-V2.0.0_2 (U1.12)
NetB2_7: MacSet-L-V2.0.0_1 (B2.7), MacSet-L-V2.0.0_2 (C27.1 D9.1 RST1.1 U1.18)
NetB2_13: MacSet-L-V2.0.0_1 (B2.13), MacSet-L-V2.0.0_2 (RX1.1 U1.10)
NetB2_14: MacSet-L-V2.0.0_1 (B2.14), MacSet-L-V2.0.0_2 (TX1.1 U1.9)
NetB2_15: MacSet-L-V2.0.0_1 (B2.15), MacSet-L-V2.0.0_2 (U1.8)
NetB3_3: MacSet-L-V2.0.0_1 (B3.3), MacSet-L-V2.0.0_2 (U1.15)
NetB3_7: MacSet-L-V2.0.0_1 (B3.7), MacSet-L-V2.0.0_2 (U1.13)
NetC1_1: MacSet-L-V2.0.0_1 (C1.1 D1.3 R1.2 R3.1), MacSet-L-V2.0.0_2 (U1.31)
NetC6_2: MacSet-L-V2.0.0_1 (C6.2 D2.3 R5.1 R6.2), MacSet-L-V2.0.0_2 (U1.1)
NetC11_1: MacSet-L-V2.0.0_1 (C11.1 D3.3 R7.2 R9.1), MacSet-L-V2.0.0_2 (U1.2)
NetC19_2: MacSet-L-V2.0.0_1 (C19.2 D4.3 R11.1 R12.2), MacSet-L-V2.0.0_2 (U1.33)
NetR14_1: MacSet-L-V2.0.0_1 (R14.1), MacSet-L-V2.0.0_2 (U1.6)
NetR16_1: MacSet-L-V2.0.0_1 (R16.1), MacSet-L-V2.0.0_2 (U1.32)
NetR22_1: MacSet-L-V2.0.0_2 (U1.4), MacSet-L-V2.0.0_3 (R22.1 U5.1)
NetR28_2: MacSet-L-V2.0.0_2 (U1.3), MacSet-L-V2.0.0_3 (R28.2 U5.2 U5.3)
NetR36_2: MacSet-L-V2.0.0_2 (U1.35), MacSet-L-V2.0.0_3 (R36.2 U7.15)
NetR37_2: MacSet-L-V2.0.0_2 (U1.34), MacSet-L-V2.0.0_3 (R37.2 U7.14)
NetU1_5: MacSet-L-V2.0.0_2 (U1.5), MacSet-L-V2.0.0_3 (U5.4)